# Altium schematic sheet RFR24 AMS Design - CAN V1.SchDoc
size A; SheetNumber: 6; SheetTotal: 10
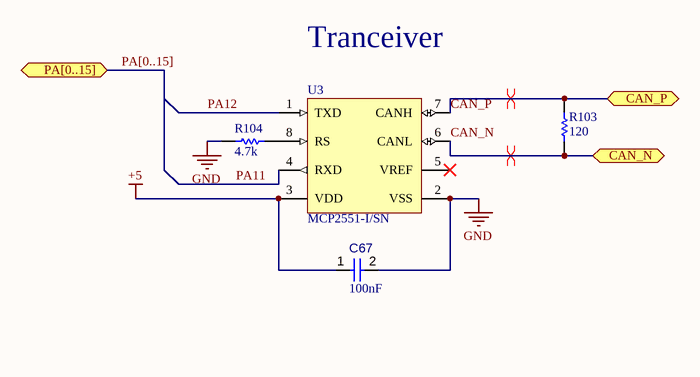
[diagram p0: RFR24 AMS Design - CAN V1.SchDoc]

## Parts
C67  value 100nF  [CAPC2013X145X50LL20T25]  (hidden comment: Capacitor 1 uF +/- 10% 25 V 0805)
R103  value 120  [RESC2013X70X40LL20T20]  (hidden comment: Resistor 1k +/-1% 0805 125 mW)  (no BOM)
R104  value 4.7k  [RESC2013X70X40LL20T20]  (hidden comment: Resistor 1k +/-1% 0805 125 mW)
U3  MCP2551-I/SN  [MCHP-SN8_V]

## Ports
CAN_N (bidir), CAN_P (bidir), PA[0..15] (bidir)

## Nets
+5: C67.1 U3.3(VDD)
GND: C67.2 R104.1 U3.2(VSS)
CAN_N: R103.2 U3.6(CANL) ; port CAN_N
CAN_P: R103.1 U3.7(CANH) ; port CAN_P
PA11: U3.4(RXD)
PA12: U3.1(TXD)
NetR104_2: R104.2 U3.8(RS)

Not connected (* = marked no-connect by the designer): U3 5(VREF)*

## Buses and harness runs
bus PA[0..15] = port PA[0..15]

## Layout directives
differential pair; rule Differential Pairs Routing [Pref Gap = 10mil    Min Gap  = 4mil    Max Gap  = 10milPref Width = 12mil    Min Width  = 7mil    Max Width  = 12mil]: CAN_P
differential pair: CAN_N

## Notes on the sheet
- Tranceiver

## Library data of the parts
C67 = CMP-001-00010-6: Chip Capacitor, 1 uF, +/-10%, 25 V, 0805 (2012 Metric); Capacitor Type: Ceramic; Voltage Rating: 25V; RoHS Compliant: True; Pins: 2; Mounting Technology: SM; Max Operating Temperature: 125°C; Min Operating Temperature: -55°C; Tolerance: 10%; Case/Package: 0805
R103 R104 = CMP-009-00010-5: Chip Resistor, 1 KOhm, +/- 1%, 0.125 W, -55 to 155 degC, 0805 (2013 Metric); Power: 125mW; Voltage Rating: 150V; Tolerance: 1%; RoHS Compliant: True; Mounting Technology: SM; Pins: 2; Case/Package: 0805; Max Operating Temperature: 155°C; Min Operating Temperature: -55°C
U3 = CMP-0186-00138-3: High-Speed CAN Transceiver, / 1 Mb/s, 4.5 to 5.5 V, 8-Pin SOIC (SN), Industrial Temperature, RoHS, Tube; Manufacturer: Microchip; RoHSCompliant: true; PackageReference: SN8; ComponentLink1URL: http://www.microchip.com/; DatasheetVersion: Rev. F, 07/2010; ComponentLink2Description: Datasheet; ComponentLink2URL: http://ww1.microchip.com/downloads/en/DeviceDoc/21667f.pdf; ComponentLink3Description: Package Specification; PackageDescription: 8-Pin Small Outline Integrated Circuit, Body 4.9 x 3.9 mm, Pitch 1.27 mm; ComponentLink1Description: Manufacturer URL; Mounting Technology: Surface Mount; ComponentLink3URL: http://www.microchip.com/stellent/groups/techpub_sg/documents/packagingspec/en012702.pdf